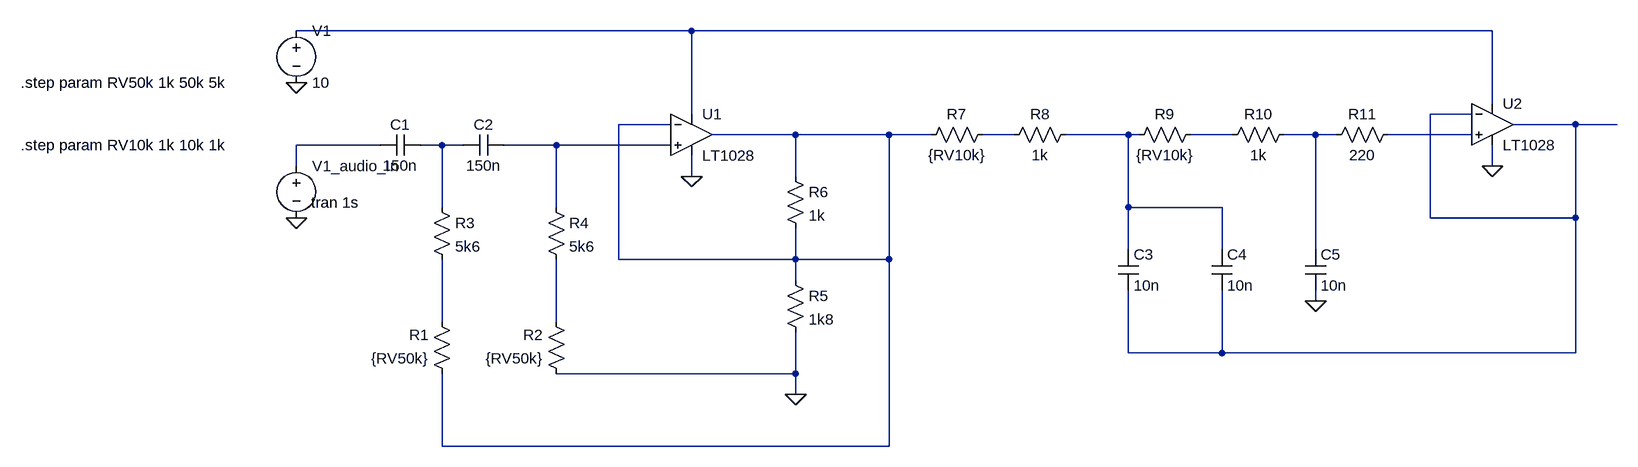
[diagram p0: schematic ActiveFilter_LTspice.asc]
ActiveFilter_LTspice.asc, the LTspice schematic file:
Version 4.1
SHEET 1 2100 680
WIRE 672 -64 64 -64
WIRE 1904 -64 672 -64
WIRE 1904 48 1904 -64
WIRE 672 64 672 -64
WIRE 1872 64 1808 64
WIRE 640 80 560 80
WIRE 2032 80 1936 80
WIRE 2096 80 2032 80
WIRE 832 96 704 96
WIRE 976 96 832 96
WIRE 1040 96 976 96
WIRE 1168 96 1120 96
WIRE 1344 96 1248 96
WIRE 1360 96 1344 96
WIRE 1504 96 1440 96
WIRE 1632 96 1584 96
WIRE 1664 96 1632 96
WIRE 1872 96 1744 96
WIRE 192 112 64 112
WIRE 288 112 256 112
WIRE 320 112 288 112
WIRE 464 112 384 112
WIRE 640 112 464 112
WIRE 64 144 64 112
WIRE 1904 144 1904 112
WIRE 672 160 672 128
WIRE 832 160 832 96
WIRE 288 208 288 112
WIRE 464 208 464 112
WIRE 1344 208 1344 96
WIRE 1488 208 1344 208
WIRE 1808 224 1808 64
WIRE 2032 224 2032 80
WIRE 2032 224 1808 224
WIRE 1344 272 1344 208
WIRE 1488 272 1488 208
WIRE 1632 272 1632 96
WIRE 560 288 560 80
WIRE 832 288 832 240
WIRE 832 288 560 288
WIRE 976 288 976 96
WIRE 976 288 832 288
WIRE 832 320 832 288
WIRE 1632 352 1632 336
WIRE 288 384 288 288
WIRE 464 384 464 288
WIRE 1344 432 1344 336
WIRE 1488 432 1488 336
WIRE 1488 432 1344 432
WIRE 2032 432 2032 224
WIRE 2032 432 1488 432
WIRE 832 464 832 400
WIRE 832 464 464 464
WIRE 832 496 832 464
WIRE 288 576 288 464
WIRE 976 576 976 288
WIRE 976 576 288 576
FLAG 64 224 0
FLAG 832 496 0
FLAG 672 160 0
FLAG 64 16 0
FLAG 1904 144 0
FLAG 1632 352 0
SYMBOL voltage 64 128 R0
WINDOW 3 24 96 Invisible 2
SYMATTR InstName V1_audio_In
SYMATTR Value wavefile="C:\Users\Tigran\Downloads\audio.wav"
SYMBOL res 304 480 R180
WINDOW 0 36 76 Left 2
WINDOW 3 36 40 Left 2
SYMATTR InstName R1
SYMATTR Value {RV50k}
SYMBOL res 480 480 R180
WINDOW 0 36 76 Left 2
WINDOW 3 36 40 Left 2
SYMATTR InstName R2
SYMATTR Value {RV50k}
SYMBOL cap 256 96 R90
WINDOW 0 0 32 VBottom 2
WINDOW 3 32 32 VTop 2
SYMATTR InstName C1
SYMATTR Value 150n
SYMBOL cap 384 96 R90
WINDOW 0 0 32 VBottom 2
WINDOW 3 32 32 VTop 2
SYMATTR InstName C2
SYMATTR Value 150n
SYMBOL res 272 192 R0
SYMATTR InstName R3
SYMATTR Value 5k6
SYMBOL res 448 192 R0
SYMATTR InstName R4
SYMATTR Value 5k6
SYMBOL OpAmps\\LT1028 672 32 R0
SYMATTR InstName U1
SYMBOL res 816 304 R0
SYMATTR InstName R5
SYMATTR Value 1k8
SYMBOL res 816 144 R0
SYMATTR InstName R6
SYMATTR Value 1k
SYMBOL voltage 64 -80 R0
WINDOW 123 0 0 Left 0
WINDOW 39 0 0 Left 0
SYMATTR InstName V1
SYMATTR Value 10
SYMBOL res 1024 112 R270
WINDOW 0 32 56 VTop 2
WINDOW 3 0 56 VBottom 2
SYMATTR InstName R7
SYMATTR Value {RV10k}
SYMBOL res 1264 80 R90
WINDOW 0 0 56 VBottom 2
WINDOW 3 32 56 VTop 2
SYMATTR InstName R8
SYMATTR Value 1k
SYMBOL res 1344 112 R270
WINDOW 0 32 56 VTop 2
WINDOW 3 0 56 VBottom 2
SYMATTR InstName R9
SYMATTR Value {RV10k}
SYMBOL res 1600 80 R90
WINDOW 0 0 56 VBottom 2
WINDOW 3 32 56 VTop 2
SYMATTR InstName R10
SYMATTR Value 1k
SYMBOL res 1760 80 R90
WINDOW 0 0 56 VBottom 2
WINDOW 3 32 56 VTop 2
SYMATTR InstName R11
SYMATTR Value 220
SYMBOL cap 1328 272 R0
SYMATTR InstName C3
SYMATTR Value 10n
SYMBOL cap 1472 272 R0
SYMATTR InstName C4
SYMATTR Value 10n
SYMBOL cap 1616 272 R0
SYMATTR InstName C5
SYMATTR Value 10n
SYMBOL OpAmps\\LT1028 1904 16 R0
SYMATTR InstName U2
TEXT 80 200 Left 2 !.tran 1s
TEXT -360 16 Left 2 !.step param RV50k 1k 50k 5k
TEXT -360 112 Left 2 !.step param RV10k 1k 10k 1k

The netlist it stands for:
* ActiveFilter_LTspice.asc
V1_audio_In N009 0 wavefile="C:\Users\Tigran\Downloads\audio.wav"
R1 N003 N012 {RV50k}
R2 0 N013 {RV50k}
C1 N010 N009 150n
C2 N011 N010 150n
R3 N010 N012 5k6
R4 N011 N013 5k6
X§U1 N011 N003 N001 0 N003 LT1028  ; pins In+ In- V+ V- OUT
R5 N003 0 1k8
R6 N003 N003 1k
V1 N001 0 10
R7 N003 N004 {RV10k}
R8 N005 N004 1k
R9 N005 N006 {RV10k}
R10 N007 N006 1k
R11 N008 N007 220
C3 N005 N002 10n
C4 N005 N002 10n
C5 N007 0 10n
X§U2 N008 N002 N001 0 N002 LT1028  ; pins In+ In- V+ V- OUT
.tran 1s
.step param RV50k 1k 50k 5k
.step param RV10k 1k 10k 1k
.lib LTC.lib
.backanno
.end